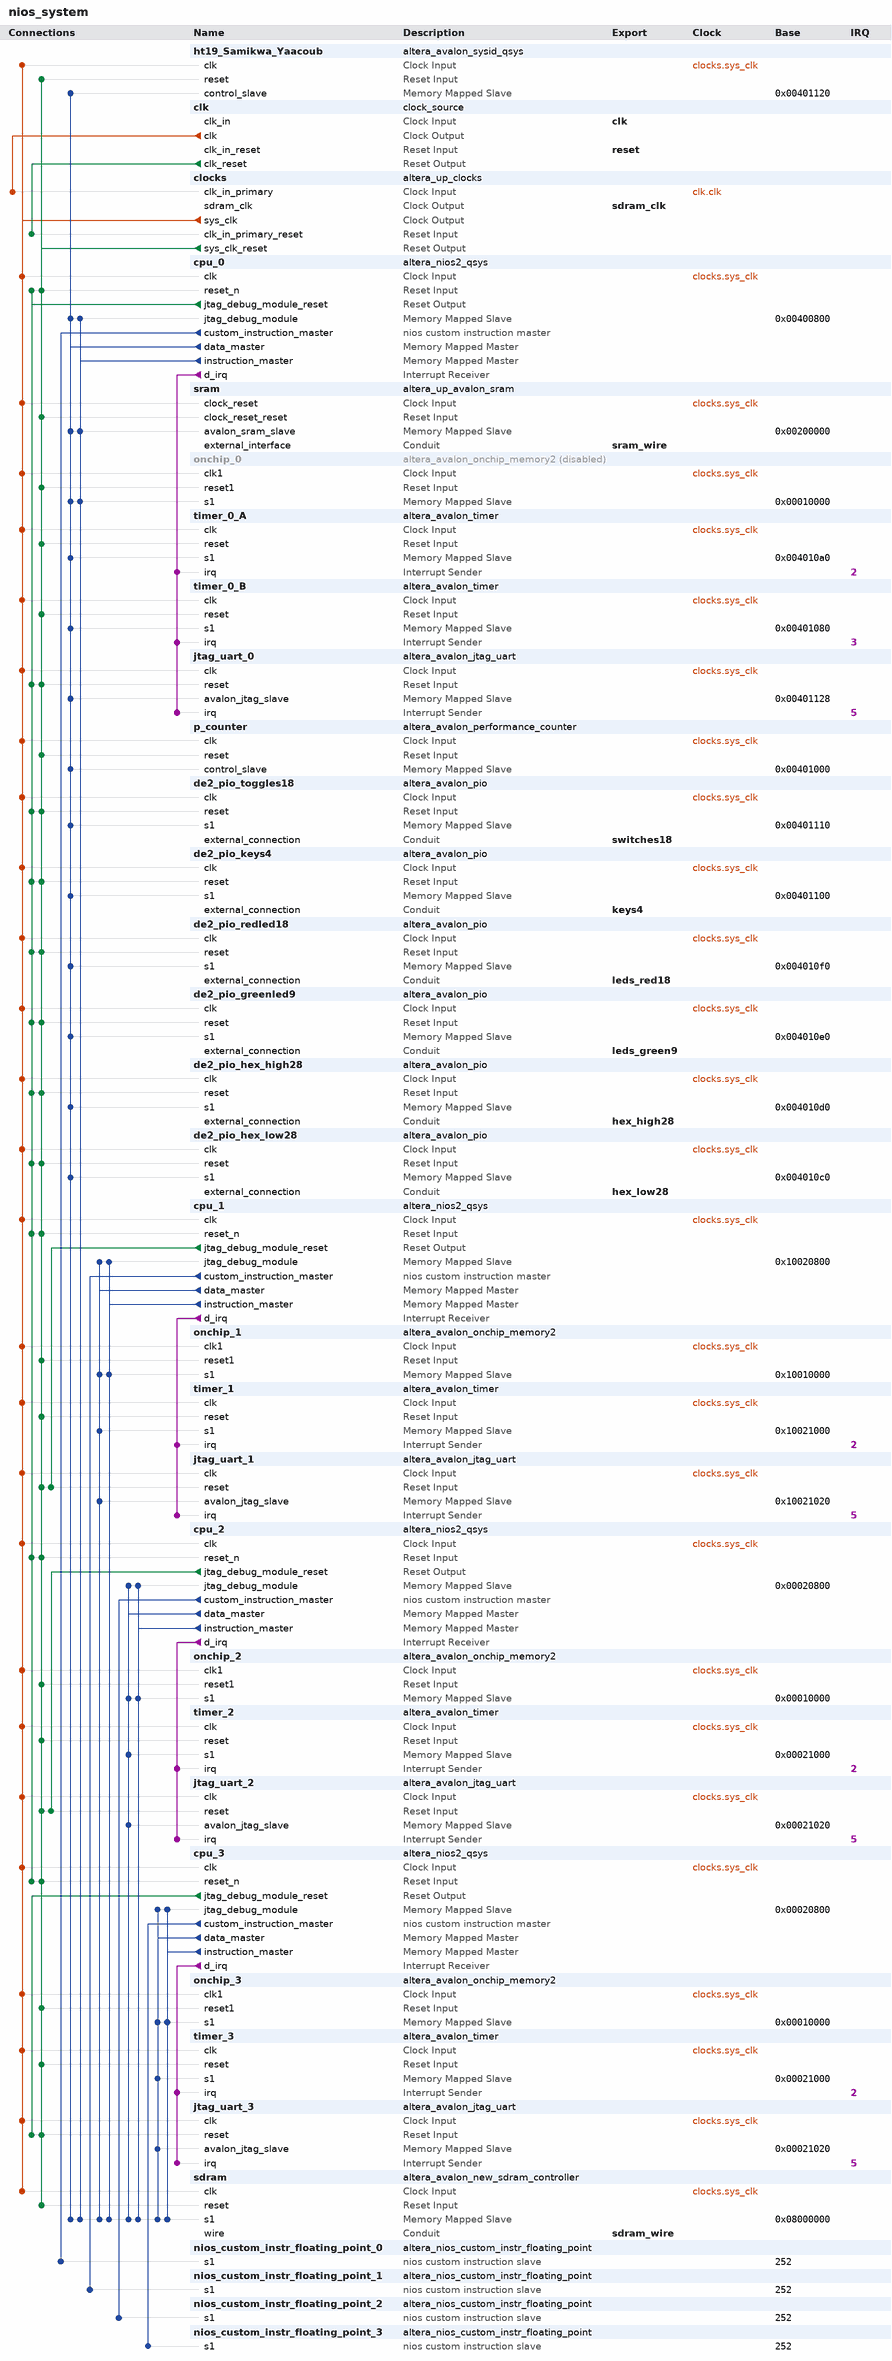
[diagram p0: system contents]
# Platform Designer (Qsys) system nios_system, Cyclone IV E EP4CE115F29C7
# Parameters at their usual value, and those the tool derives, are not listed.
package require -exact qsys 13.0.1.99.2
create_system nios_system
set_project_property DEVICE_FAMILY {Cyclone IV E}
set_project_property DEVICE EP4CE115F29C7

add_instance ht19_Samikwa_Yaacoub altera_avalon_sysid_qsys 13.0
set_instance_parameter_value ht19_Samikwa_Yaacoub id 34566365

add_instance clk clock_source 13.0
set_instance_parameter_value clk clockFrequency 50000000

add_instance clocks altera_up_clocks 13.0
set_instance_parameter_value clocks board DE2-115
set_instance_parameter_value clocks vga_clk false
set_instance_parameter_value clocks audio_clk false
set_instance_parameter_value clocks audio_clk_freq 12.288

add_instance cpu_0 altera_nios2_qsys 13.0
set_instance_parameter_value cpu_0 resetSlave sram.avalon_sram_slave
set_instance_parameter_value cpu_0 mmu_TLBMissExcSlave None
set_instance_parameter_value cpu_0 exceptionSlave sram.avalon_sram_slave
set_instance_parameter_value cpu_0 breakSlave cpu_0.jtag_debug_module
set_instance_parameter_value cpu_0 impl Tiny
set_instance_parameter_value cpu_0 icache_size 4096

add_instance sram altera_up_avalon_sram 13.0
set_instance_parameter_value sram board DE2-115
set_instance_parameter_value sram pixel_buffer false

add_instance onchip_0 altera_avalon_onchip_memory2 13.0.1.99.2
set_instance_property onchip_0 ENABLED false
set_instance_parameter_value onchip_0 dataWidth 32
set_instance_parameter_value onchip_0 dualPort false
set_instance_parameter_value onchip_0 initMemContent true
set_instance_parameter_value onchip_0 initializationFileName onchip_mem.hex
set_instance_parameter_value onchip_0 memorySize 65536

add_instance timer_0_A altera_avalon_timer 13.0.1.99.2
set_instance_parameter_value timer_0_A period 1
set_instance_parameter_value timer_0_A periodUnits MSEC

add_instance timer_0_B altera_avalon_timer 13.0.1.99.2
set_instance_parameter_value timer_0_B period 2
set_instance_parameter_value timer_0_B periodUnits MSEC

add_instance jtag_uart_0 altera_avalon_jtag_uart 13.0.1.99.2
set_instance_parameter_value jtag_uart_0 simInteractiveOptions NO_INTERACTIVE_WINDOWS

add_instance p_counter altera_avalon_performance_counter 13.0.1.99.2
set_instance_parameter_value p_counter numberOfSections 7

add_instance de2_pio_toggles18 altera_avalon_pio 13.0.1.99.2
set_instance_parameter_value de2_pio_toggles18 captureEdge true
set_instance_parameter_value de2_pio_toggles18 direction Input
set_instance_parameter_value de2_pio_toggles18 edgeType FALLING
set_instance_parameter_value de2_pio_toggles18 irqType EDGE
set_instance_parameter_value de2_pio_toggles18 width 18

add_instance de2_pio_keys4 altera_avalon_pio 13.0.1.99.2
set_instance_parameter_value de2_pio_keys4 direction Input
set_instance_parameter_value de2_pio_keys4 width 4

add_instance de2_pio_redled18 altera_avalon_pio 13.0.1.99.2
set_instance_parameter_value de2_pio_redled18 direction Output
set_instance_parameter_value de2_pio_redled18 width 18

add_instance de2_pio_greenled9 altera_avalon_pio 13.0.1.99.2
set_instance_parameter_value de2_pio_greenled9 direction Output
set_instance_parameter_value de2_pio_greenled9 width 9

add_instance de2_pio_hex_high28 altera_avalon_pio 13.0.1.99.2
set_instance_parameter_value de2_pio_hex_high28 direction Output
set_instance_parameter_value de2_pio_hex_high28 width 28

add_instance de2_pio_hex_low28 altera_avalon_pio 13.0.1.99.2
set_instance_parameter_value de2_pio_hex_low28 direction Output
set_instance_parameter_value de2_pio_hex_low28 width 28

add_instance cpu_1 altera_nios2_qsys 13.0
set_instance_parameter_value cpu_1 resetSlave onchip_1.s1
set_instance_parameter_value cpu_1 mmu_TLBMissExcSlave None
set_instance_parameter_value cpu_1 exceptionSlave onchip_1.s1
set_instance_parameter_value cpu_1 breakSlave cpu_1.jtag_debug_module
set_instance_parameter_value cpu_1 impl Tiny
set_instance_parameter_value cpu_1 icache_size 4096

add_instance onchip_1 altera_avalon_onchip_memory2 13.0.1.99.2
set_instance_parameter_value onchip_1 dataWidth 32
set_instance_parameter_value onchip_1 dualPort false
set_instance_parameter_value onchip_1 initMemContent true
set_instance_parameter_value onchip_1 initializationFileName onchip_mem.hex
set_instance_parameter_value onchip_1 memorySize 65536

add_instance timer_1 altera_avalon_timer 13.0.1.99.2
set_instance_parameter_value timer_1 period 1
set_instance_parameter_value timer_1 periodUnits MSEC

add_instance jtag_uart_1 altera_avalon_jtag_uart 13.0.1.99.2
set_instance_parameter_value jtag_uart_1 simInteractiveOptions NO_INTERACTIVE_WINDOWS

add_instance cpu_2 altera_nios2_qsys 13.0
set_instance_parameter_value cpu_2 resetSlave onchip_2.s1
set_instance_parameter_value cpu_2 mmu_TLBMissExcSlave None
set_instance_parameter_value cpu_2 exceptionSlave onchip_2.s1
set_instance_parameter_value cpu_2 breakSlave cpu_2.jtag_debug_module
set_instance_parameter_value cpu_2 impl Tiny
set_instance_parameter_value cpu_2 icache_size 4096

add_instance onchip_2 altera_avalon_onchip_memory2 13.0.1.99.2
set_instance_parameter_value onchip_2 dataWidth 32
set_instance_parameter_value onchip_2 dualPort false
set_instance_parameter_value onchip_2 initMemContent true
set_instance_parameter_value onchip_2 initializationFileName onchip_mem.hex
set_instance_parameter_value onchip_2 memorySize 65536

add_instance timer_2 altera_avalon_timer 13.0.1.99.2
set_instance_parameter_value timer_2 period 1
set_instance_parameter_value timer_2 periodUnits MSEC

add_instance jtag_uart_2 altera_avalon_jtag_uart 13.0.1.99.2
set_instance_parameter_value jtag_uart_2 simInteractiveOptions NO_INTERACTIVE_WINDOWS

add_instance cpu_3 altera_nios2_qsys 13.0
set_instance_parameter_value cpu_3 resetSlave onchip_3.s1
set_instance_parameter_value cpu_3 mmu_TLBMissExcSlave None
set_instance_parameter_value cpu_3 exceptionSlave onchip_3.s1
set_instance_parameter_value cpu_3 breakSlave cpu_3.jtag_debug_module
set_instance_parameter_value cpu_3 impl Tiny
set_instance_parameter_value cpu_3 icache_size 4096

add_instance onchip_3 altera_avalon_onchip_memory2 13.0.1.99.2
set_instance_parameter_value onchip_3 dataWidth 32
set_instance_parameter_value onchip_3 dualPort false
set_instance_parameter_value onchip_3 initMemContent true
set_instance_parameter_value onchip_3 initializationFileName onchip_mem.hex
set_instance_parameter_value onchip_3 memorySize 65536

add_instance timer_3 altera_avalon_timer 13.0.1.99.2
set_instance_parameter_value timer_3 period 1
set_instance_parameter_value timer_3 periodUnits MSEC

add_instance jtag_uart_3 altera_avalon_jtag_uart 13.0.1.99.2
set_instance_parameter_value jtag_uart_3 simInteractiveOptions NO_INTERACTIVE_WINDOWS

add_instance sdram altera_avalon_new_sdram_controller 13.0.1.99.2
set_instance_parameter_value sdram TAC 5.5
set_instance_parameter_value sdram TRCD 20.0
set_instance_parameter_value sdram TRP 20.0
set_instance_parameter_value sdram casLatency 3
set_instance_parameter_value sdram columnWidth 10
set_instance_parameter_value sdram dataWidth 32
set_instance_parameter_value sdram generateSimulationModel false
set_instance_parameter_value sdram model single_Micron_MT48LC4M32B2_7_chip
set_instance_parameter_value sdram numberOfBanks 4
set_instance_parameter_value sdram numberOfChipSelects 1
set_instance_parameter_value sdram powerUpDelay 200.0
set_instance_parameter_value sdram refreshPeriod 7.8125
set_instance_parameter_value sdram rowWidth 13

add_instance nios_custom_instr_floating_point_0 altera_nios_custom_instr_floating_point 13.0

add_instance nios_custom_instr_floating_point_1 altera_nios_custom_instr_floating_point 13.0

add_instance nios_custom_instr_floating_point_2 altera_nios_custom_instr_floating_point 13.0

add_instance nios_custom_instr_floating_point_3 altera_nios_custom_instr_floating_point 13.0

# connections
add_connection clk.clk clocks.clk_in_primary clock
add_connection clocks.sys_clk cpu_0.clk clock
add_connection clocks.sys_clk cpu_1.clk clock
add_connection clocks.sys_clk cpu_2.clk clock
add_connection clocks.sys_clk cpu_3.clk clock
add_connection clocks.sys_clk de2_pio_greenled9.clk clock
add_connection clocks.sys_clk de2_pio_hex_high28.clk clock
add_connection clocks.sys_clk de2_pio_hex_low28.clk clock
add_connection clocks.sys_clk de2_pio_keys4.clk clock
add_connection clocks.sys_clk de2_pio_redled18.clk clock
add_connection clocks.sys_clk de2_pio_toggles18.clk clock
add_connection clocks.sys_clk ht19_Samikwa_Yaacoub.clk clock
add_connection clocks.sys_clk jtag_uart_0.clk clock
add_connection clocks.sys_clk jtag_uart_1.clk clock
add_connection clocks.sys_clk jtag_uart_2.clk clock
add_connection clocks.sys_clk jtag_uart_3.clk clock
add_connection clocks.sys_clk onchip_0.clk1 clock
add_connection clocks.sys_clk onchip_1.clk1 clock
add_connection clocks.sys_clk onchip_2.clk1 clock
add_connection clocks.sys_clk onchip_3.clk1 clock
add_connection clocks.sys_clk p_counter.clk clock
add_connection clocks.sys_clk sdram.clk clock
add_connection clocks.sys_clk sram.clock_reset clock
add_connection clocks.sys_clk timer_0_A.clk clock
add_connection clocks.sys_clk timer_0_B.clk clock
add_connection clocks.sys_clk timer_1.clk clock
add_connection clocks.sys_clk timer_2.clk clock
add_connection clocks.sys_clk timer_3.clk clock
add_connection clk.clk_reset clocks.clk_in_primary_reset reset
add_connection clocks.sys_clk_reset cpu_0.reset_n reset
add_connection clocks.sys_clk_reset cpu_1.reset_n reset
add_connection clocks.sys_clk_reset cpu_2.reset_n reset
add_connection clocks.sys_clk_reset cpu_3.reset_n reset
add_connection clocks.sys_clk_reset de2_pio_greenled9.reset reset
add_connection clocks.sys_clk_reset de2_pio_hex_high28.reset reset
add_connection clocks.sys_clk_reset de2_pio_hex_low28.reset reset
add_connection clocks.sys_clk_reset de2_pio_keys4.reset reset
add_connection clocks.sys_clk_reset de2_pio_redled18.reset reset
add_connection clocks.sys_clk_reset de2_pio_toggles18.reset reset
add_connection clocks.sys_clk_reset ht19_Samikwa_Yaacoub.reset reset
add_connection clocks.sys_clk_reset jtag_uart_0.reset reset
add_connection clocks.sys_clk_reset jtag_uart_1.reset reset
add_connection clocks.sys_clk_reset jtag_uart_2.reset reset
add_connection clocks.sys_clk_reset jtag_uart_3.reset reset
add_connection clocks.sys_clk_reset onchip_0.reset1 reset
add_connection clocks.sys_clk_reset onchip_1.reset1 reset
add_connection clocks.sys_clk_reset onchip_2.reset1 reset
add_connection clocks.sys_clk_reset onchip_3.reset1 reset
add_connection clocks.sys_clk_reset p_counter.reset reset
add_connection clocks.sys_clk_reset sdram.reset reset
add_connection clocks.sys_clk_reset sram.clock_reset_reset reset
add_connection clocks.sys_clk_reset timer_0_A.reset reset
add_connection clocks.sys_clk_reset timer_0_B.reset reset
add_connection clocks.sys_clk_reset timer_1.reset reset
add_connection clocks.sys_clk_reset timer_2.reset reset
add_connection clocks.sys_clk_reset timer_3.reset reset
add_connection cpu_0.jtag_debug_module_reset cpu_0.reset_n reset
add_connection cpu_0.jtag_debug_module_reset cpu_1.reset_n reset
add_connection cpu_0.jtag_debug_module_reset cpu_2.reset_n reset
add_connection cpu_0.jtag_debug_module_reset cpu_3.reset_n reset
add_connection cpu_0.jtag_debug_module_reset de2_pio_greenled9.reset reset
add_connection cpu_0.jtag_debug_module_reset de2_pio_hex_high28.reset reset
add_connection cpu_0.jtag_debug_module_reset de2_pio_hex_low28.reset reset
add_connection cpu_0.jtag_debug_module_reset de2_pio_keys4.reset reset
add_connection cpu_0.jtag_debug_module_reset de2_pio_redled18.reset reset
add_connection cpu_0.jtag_debug_module_reset de2_pio_toggles18.reset reset
add_connection cpu_0.jtag_debug_module_reset jtag_uart_0.reset reset
add_connection cpu_1.jtag_debug_module_reset jtag_uart_1.reset reset
add_connection cpu_2.jtag_debug_module_reset jtag_uart_2.reset reset
add_connection cpu_3.jtag_debug_module_reset jtag_uart_3.reset reset
add_connection cpu_0.data_master cpu_0.jtag_debug_module avalon
set_connection_parameter_value cpu_0.data_master/cpu_0.jtag_debug_module baseAddress 0x00400800
add_connection cpu_0.data_master de2_pio_greenled9.s1 avalon
set_connection_parameter_value cpu_0.data_master/de2_pio_greenled9.s1 baseAddress 0x004010e0
add_connection cpu_0.data_master de2_pio_hex_high28.s1 avalon
set_connection_parameter_value cpu_0.data_master/de2_pio_hex_high28.s1 baseAddress 0x004010d0
add_connection cpu_0.data_master de2_pio_hex_low28.s1 avalon
set_connection_parameter_value cpu_0.data_master/de2_pio_hex_low28.s1 baseAddress 0x004010c0
add_connection cpu_0.data_master de2_pio_keys4.s1 avalon
set_connection_parameter_value cpu_0.data_master/de2_pio_keys4.s1 baseAddress 0x00401100
add_connection cpu_0.data_master de2_pio_redled18.s1 avalon
set_connection_parameter_value cpu_0.data_master/de2_pio_redled18.s1 baseAddress 0x004010f0
add_connection cpu_0.data_master de2_pio_toggles18.s1 avalon
set_connection_parameter_value cpu_0.data_master/de2_pio_toggles18.s1 baseAddress 0x00401110
add_connection cpu_0.data_master ht19_Samikwa_Yaacoub.control_slave avalon
set_connection_parameter_value cpu_0.data_master/ht19_Samikwa_Yaacoub.control_slave baseAddress 0x00401120
add_connection cpu_0.data_master jtag_uart_0.avalon_jtag_slave avalon
set_connection_parameter_value cpu_0.data_master/jtag_uart_0.avalon_jtag_slave baseAddress 0x00401128
add_connection cpu_0.data_master onchip_0.s1 avalon
set_connection_parameter_value cpu_0.data_master/onchip_0.s1 baseAddress 0x00010000
add_connection cpu_0.data_master p_counter.control_slave avalon
set_connection_parameter_value cpu_0.data_master/p_counter.control_slave baseAddress 0x00401000
add_connection cpu_0.data_master sdram.s1 avalon
set_connection_parameter_value cpu_0.data_master/sdram.s1 baseAddress 0x08000000
add_connection cpu_0.data_master sram.avalon_sram_slave avalon
set_connection_parameter_value cpu_0.data_master/sram.avalon_sram_slave baseAddress 0x00200000
add_connection cpu_0.data_master timer_0_A.s1 avalon
set_connection_parameter_value cpu_0.data_master/timer_0_A.s1 baseAddress 0x004010a0
add_connection cpu_0.data_master timer_0_B.s1 avalon
set_connection_parameter_value cpu_0.data_master/timer_0_B.s1 baseAddress 0x00401080
add_connection cpu_0.instruction_master cpu_0.jtag_debug_module avalon
set_connection_parameter_value cpu_0.instruction_master/cpu_0.jtag_debug_module baseAddress 0x00400800
add_connection cpu_0.instruction_master onchip_0.s1 avalon
set_connection_parameter_value cpu_0.instruction_master/onchip_0.s1 baseAddress 0x00010000
add_connection cpu_0.instruction_master sdram.s1 avalon
set_connection_parameter_value cpu_0.instruction_master/sdram.s1 baseAddress 0x08000000
add_connection cpu_0.instruction_master sram.avalon_sram_slave avalon
set_connection_parameter_value cpu_0.instruction_master/sram.avalon_sram_slave baseAddress 0x00200000
add_connection cpu_1.data_master cpu_1.jtag_debug_module avalon
set_connection_parameter_value cpu_1.data_master/cpu_1.jtag_debug_module baseAddress 0x10020800
add_connection cpu_1.data_master jtag_uart_1.avalon_jtag_slave avalon
set_connection_parameter_value cpu_1.data_master/jtag_uart_1.avalon_jtag_slave baseAddress 0x10021020
add_connection cpu_1.data_master onchip_1.s1 avalon
set_connection_parameter_value cpu_1.data_master/onchip_1.s1 baseAddress 0x10010000
add_connection cpu_1.data_master sdram.s1 avalon
set_connection_parameter_value cpu_1.data_master/sdram.s1 baseAddress 0x08000000
add_connection cpu_1.data_master timer_1.s1 avalon
set_connection_parameter_value cpu_1.data_master/timer_1.s1 baseAddress 0x10021000
add_connection cpu_1.instruction_master cpu_1.jtag_debug_module avalon
set_connection_parameter_value cpu_1.instruction_master/cpu_1.jtag_debug_module baseAddress 0x10020800
add_connection cpu_1.instruction_master onchip_1.s1 avalon
set_connection_parameter_value cpu_1.instruction_master/onchip_1.s1 baseAddress 0x10010000
add_connection cpu_1.instruction_master sdram.s1 avalon
set_connection_parameter_value cpu_1.instruction_master/sdram.s1 baseAddress 0x08000000
add_connection cpu_2.data_master cpu_2.jtag_debug_module avalon
set_connection_parameter_value cpu_2.data_master/cpu_2.jtag_debug_module baseAddress 0x00020800
add_connection cpu_2.data_master jtag_uart_2.avalon_jtag_slave avalon
set_connection_parameter_value cpu_2.data_master/jtag_uart_2.avalon_jtag_slave baseAddress 0x00021020
add_connection cpu_2.data_master onchip_2.s1 avalon
set_connection_parameter_value cpu_2.data_master/onchip_2.s1 baseAddress 0x00010000
add_connection cpu_2.data_master sdram.s1 avalon
set_connection_parameter_value cpu_2.data_master/sdram.s1 baseAddress 0x08000000
add_connection cpu_2.data_master timer_2.s1 avalon
set_connection_parameter_value cpu_2.data_master/timer_2.s1 baseAddress 0x00021000
add_connection cpu_2.instruction_master cpu_2.jtag_debug_module avalon
set_connection_parameter_value cpu_2.instruction_master/cpu_2.jtag_debug_module baseAddress 0x00020800
add_connection cpu_2.instruction_master onchip_2.s1 avalon
set_connection_parameter_value cpu_2.instruction_master/onchip_2.s1 baseAddress 0x00010000
add_connection cpu_2.instruction_master sdram.s1 avalon
set_connection_parameter_value cpu_2.instruction_master/sdram.s1 baseAddress 0x08000000
add_connection cpu_3.data_master cpu_3.jtag_debug_module avalon
set_connection_parameter_value cpu_3.data_master/cpu_3.jtag_debug_module baseAddress 0x00020800
add_connection cpu_3.data_master jtag_uart_3.avalon_jtag_slave avalon
set_connection_parameter_value cpu_3.data_master/jtag_uart_3.avalon_jtag_slave baseAddress 0x00021020
add_connection cpu_3.data_master onchip_3.s1 avalon
set_connection_parameter_value cpu_3.data_master/onchip_3.s1 baseAddress 0x00010000
add_connection cpu_3.data_master sdram.s1 avalon
set_connection_parameter_value cpu_3.data_master/sdram.s1 baseAddress 0x08000000
add_connection cpu_3.data_master timer_3.s1 avalon
set_connection_parameter_value cpu_3.data_master/timer_3.s1 baseAddress 0x00021000
add_connection cpu_3.instruction_master cpu_3.jtag_debug_module avalon
set_connection_parameter_value cpu_3.instruction_master/cpu_3.jtag_debug_module baseAddress 0x00020800
add_connection cpu_3.instruction_master onchip_3.s1 avalon
set_connection_parameter_value cpu_3.instruction_master/onchip_3.s1 baseAddress 0x00010000
add_connection cpu_3.instruction_master sdram.s1 avalon
set_connection_parameter_value cpu_3.instruction_master/sdram.s1 baseAddress 0x08000000
add_connection cpu_0.d_irq jtag_uart_0.irq interrupt
set_connection_parameter_value cpu_0.d_irq/jtag_uart_0.irq irqNumber 5
add_connection cpu_0.d_irq timer_0_A.irq interrupt
set_connection_parameter_value cpu_0.d_irq/timer_0_A.irq irqNumber 2
add_connection cpu_0.d_irq timer_0_B.irq interrupt
set_connection_parameter_value cpu_0.d_irq/timer_0_B.irq irqNumber 3
add_connection cpu_1.d_irq jtag_uart_1.irq interrupt
set_connection_parameter_value cpu_1.d_irq/jtag_uart_1.irq irqNumber 5
add_connection cpu_1.d_irq timer_1.irq interrupt
set_connection_parameter_value cpu_1.d_irq/timer_1.irq irqNumber 2
add_connection cpu_2.d_irq jtag_uart_2.irq interrupt
set_connection_parameter_value cpu_2.d_irq/jtag_uart_2.irq irqNumber 5
add_connection cpu_2.d_irq timer_2.irq interrupt
set_connection_parameter_value cpu_2.d_irq/timer_2.irq irqNumber 2
add_connection cpu_3.d_irq jtag_uart_3.irq interrupt
set_connection_parameter_value cpu_3.d_irq/jtag_uart_3.irq irqNumber 5
add_connection cpu_3.d_irq timer_3.irq interrupt
set_connection_parameter_value cpu_3.d_irq/timer_3.irq irqNumber 2
add_connection cpu_0.custom_instruction_master nios_custom_instr_floating_point_0.s1 nios_custom_instruction
set_connection_parameter_value cpu_0.custom_instruction_master/nios_custom_instr_floating_point_0.s1 CIName nios_custom_instr_floating_point_0
set_connection_parameter_value cpu_0.custom_instruction_master/nios_custom_instr_floating_point_0.s1 baseAddress 252
add_connection cpu_1.custom_instruction_master nios_custom_instr_floating_point_1.s1 nios_custom_instruction
set_connection_parameter_value cpu_1.custom_instruction_master/nios_custom_instr_floating_point_1.s1 CIName nios_custom_instr_floating_point_1
set_connection_parameter_value cpu_1.custom_instruction_master/nios_custom_instr_floating_point_1.s1 baseAddress 252
add_connection cpu_2.custom_instruction_master nios_custom_instr_floating_point_2.s1 nios_custom_instruction
set_connection_parameter_value cpu_2.custom_instruction_master/nios_custom_instr_floating_point_2.s1 CIName nios_custom_instr_floating_point_2
set_connection_parameter_value cpu_2.custom_instruction_master/nios_custom_instr_floating_point_2.s1 baseAddress 252
add_connection cpu_3.custom_instruction_master nios_custom_instr_floating_point_3.s1 nios_custom_instruction
set_connection_parameter_value cpu_3.custom_instruction_master/nios_custom_instr_floating_point_3.s1 CIName nios_custom_instr_floating_point_3
set_connection_parameter_value cpu_3.custom_instruction_master/nios_custom_instr_floating_point_3.s1 baseAddress 252

# exported interfaces
add_interface switches18 conduit end
set_interface_property switches18 EXPORT_OF de2_pio_toggles18.external_connection
add_interface keys4 conduit end
set_interface_property keys4 EXPORT_OF de2_pio_keys4.external_connection
add_interface leds_red18 conduit end
set_interface_property leds_red18 EXPORT_OF de2_pio_redled18.external_connection
add_interface leds_green9 conduit end
set_interface_property leds_green9 EXPORT_OF de2_pio_greenled9.external_connection
add_interface hex_high28 conduit end
set_interface_property hex_high28 EXPORT_OF de2_pio_hex_high28.external_connection
add_interface hex_low28 conduit end
set_interface_property hex_low28 EXPORT_OF de2_pio_hex_low28.external_connection
add_interface sdram_wire conduit end
set_interface_property sdram_wire EXPORT_OF sdram.wire
add_interface sram_wire conduit end
set_interface_property sram_wire EXPORT_OF sram.external_interface
add_interface sdram_clk clock source
set_interface_property sdram_clk EXPORT_OF clocks.sdram_clk
add_interface reset reset sink
set_interface_property reset EXPORT_OF clk.clk_in_reset
add_interface clk clock sink
set_interface_property clk EXPORT_OF clk.clk_in

set_interconnect_requirement {$system} qsys_mm.clockCrossingAdapter HANDSHAKE
set_interconnect_requirement {$system} qsys_mm.maxAdditionalLatency 1

save_system nios_system.qsys
